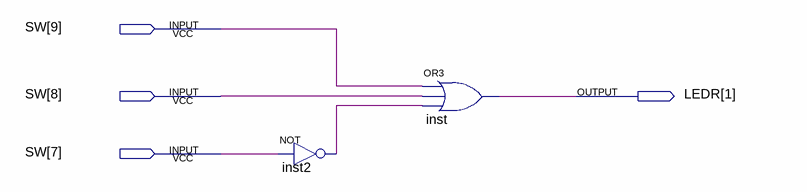
[diagram p0: schematic sheet]
// Quartus schematic Cenario2.bdf as structural Verilog: 2 symbols, 4 pins
module Cenario2 (
  input  [9:7] SW,
  output [1:1] LEDR
);

  wire inst2_out;

  not inst2 (inst2_out, SW[7]);
  or inst (LEDR[1], SW[9], SW[8], inst2_out);
endmodule
